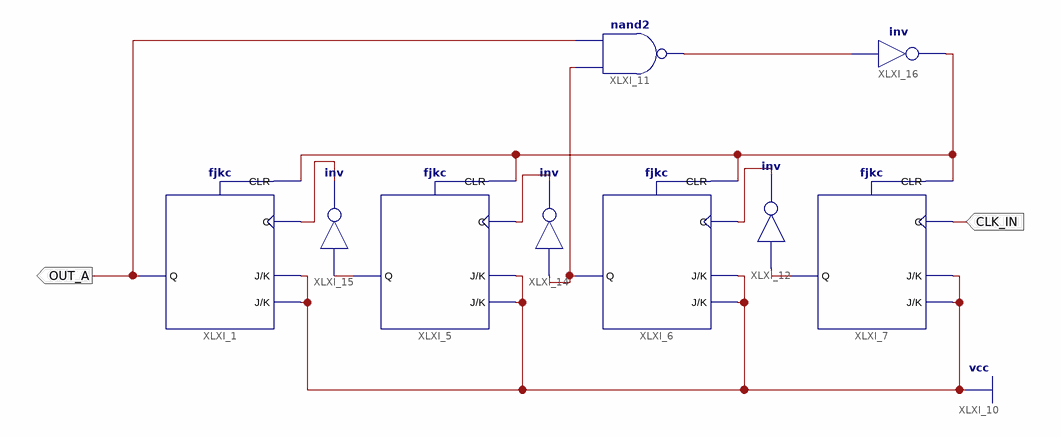
[diagram p0: schematic sheet 1]
// Xilinx ISE schematic mod10.sch (spartan6) as structural Verilog: 9 symbols, 2 ports
module mod10 (
  input  CLK_IN,
  output OUT_A
);

  wire XLXN_29, XLXN_35, XLXN_36, XLXN_38, XLXN_40, XLXN_41, XLXN_43, XLXN_47;

  fjkc XLXI_1 (.C(XLXN_38), .CLR(XLXN_41), .J(1'b1), .K(1'b1), .Q(OUT_A));
  fjkc XLXI_5 (.C(XLXN_36), .CLR(XLXN_41), .J(1'b1), .K(1'b1), .Q(XLXN_40));
  fjkc XLXI_6 (.C(XLXN_29), .CLR(XLXN_41), .J(1'b1), .K(1'b1), .Q(XLXN_35));
  fjkc XLXI_7 (.C(CLK_IN), .CLR(XLXN_41), .J(1'b1), .K(1'b1), .Q(XLXN_47));
  nand XLXI_11 (XLXN_43, XLXN_35, OUT_A);
  not XLXI_12 (XLXN_29, XLXN_47);
  not XLXI_14 (XLXN_36, XLXN_35);
  not XLXI_15 (XLXN_38, XLXN_40);
  not XLXI_16 (XLXN_41, XLXN_43);
endmodule
